# Altium schematic sheet MCU.SchDoc
size A4; SheetNumber: 2; SheetTotal: 4
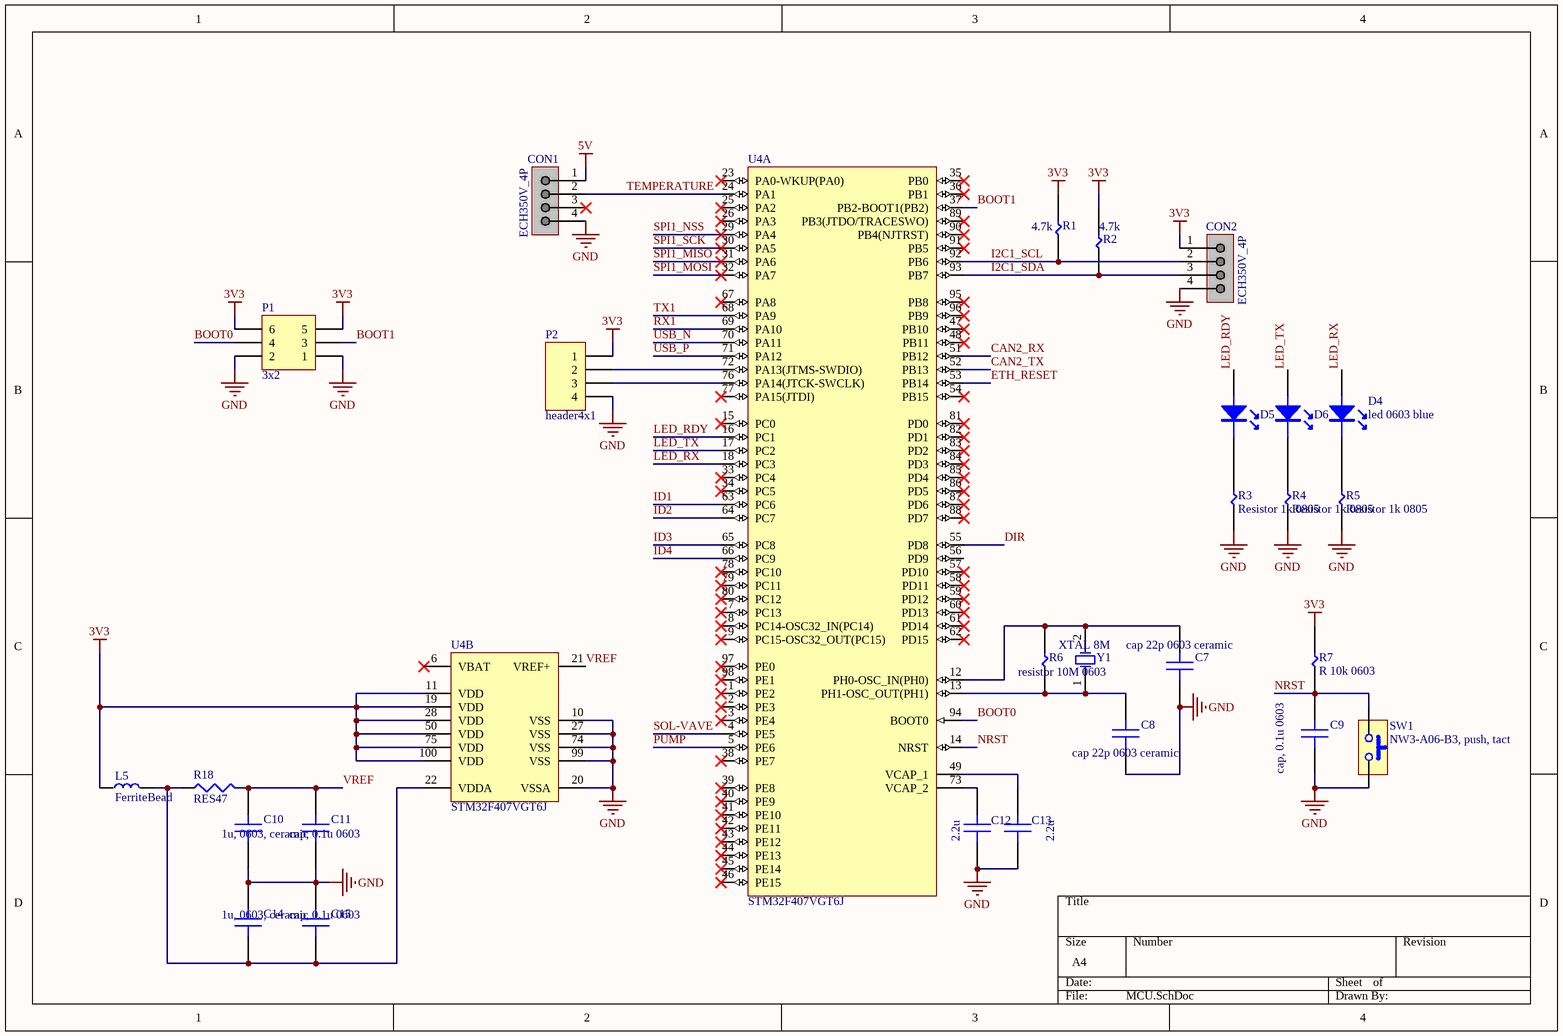
[diagram p0: MCU.SchDoc]

## Parts
C7  cap 22p 0603 ceramic  [CAP22p_0603_ceramic]
C8  cap 22p 0603 ceramic  [CAP22p_0603_ceramic]
C9  cap, 0.1u 0603  [CAP0.1u_0603_ceramic]
C10  1u, 0603, ceramic  [CAP1u_0603_ceramic]
C11  cap, 0.1u 0603  [CAP0.1u_0603_ceramic]
C12  2.2u  [CAP2.2u_0603]
C13  2.2u  [CAP2.2u_0603]
C14  1u, 0603, ceramic  [CAP1u_0603_ceramic]
C15  cap, 0.1u 0603  [CAP0.1u_0603_ceramic]
CON1  ECH350V_4P  [CON4P_ECH350V]
CON2  ECH350V_4P  [CON4P_ECH350V]
D4  led 0603 blue  [LED0603_BLUE]
D5  LED  [LED0603_GREEN]  (value not drawn)
D6  LED  [LED0603_GREEN]  (value not drawn)
L5  FerriteBead  [FerriteBD1608_102]
P1  3x2  [HDR3X2]
P2  header4x1  [HEADER4X1]
R1  4.7k  [RES4.7k_0603]
R2  4.7k  [RES4.7k_0603]
R3  Resistor 1k 0805  [RES1K_0805]
R4  Resistor 1k 0805  [RES1K_0805]
R5  Resistor 1k 0805  [RES1K_0805]
R6  resistor 10M 0603  [RES10M_0603]
R7  R 10k 0603  [RES10K_0603]
R18  RES47  [RES47_0603]
SW1  NW3-A06-B3, push, tact  [SW_TACT1]
U4  STM32F407VGT6J  [STM-LQFP100_L]  (parts A,B of 2)
Y1  XTAL 8M  [XTAL_SMD_8M]

## Nets
3V3: CON2.1 L5.1 P1.5 P1.6 P2.1 R1.2 R2.2 R7.2 U4.11(VDD) U4.19(VDD) U4.28(VDD) U4.50(VDD) U4.75(VDD) U4.100(VDD)
5V: CON1.1
GND: C7.1 C8.1 C9.1 C10.1 C11.1 C12.1 C13.1 C14.2 C15.2 CON1.4 CON2.4 P1.1 P1.2 P2.4 R3.1 R4.1 R5.1 SW1.2 U4.10(VSS) U4.20(VSSA) U4.27(VSS) U4.74(VSS) U4.99(VSS)
BOOT0: P1.4 U4.94(BOOT0)
BOOT1: P1.3 U4.37(PB2-BOOT1(PB2))
CAN2_RX: U4.51(PB12)
CAN2_TX: U4.52(PB13)
DIR: U4.55(PD8)
ETH_RESET: U4.53(PB14)
I2C1_SCL: CON2.2 R1.1 U4.92(PB6)
I2C1_SDA: CON2.3 R2.1 U4.93(PB7)
ID1: U4.63(PC6)
ID2: U4.64(PC7)
ID3: U4.65(PC8)
ID4: U4.66(PC9)
LED_RDY: D5.A U4.16(PC1)
LED_RX: D4.A U4.18(PC3)
LED_TX: D6.A U4.17(PC2)
NRST: C9.2 R7.1 SW1.1 U4.14(NRST)
PUMP: U4.5(PE6)
RX1: U4.69(PA10)
SOL-VAVE: U4.4(PE5)
SPI1_MISO: U4.31(PA6)
SPI1_MOSI: U4.32(PA7)
SPI1_NSS: U4.29(PA4)
SPI1_SCK: U4.30(PA5)
TEMPERATURE: CON1.2 U4.24(PA1)
TX1: U4.68(PA9)
USB_N: U4.70(PA11)
USB_P: U4.71(PA12)
VREF: C10.2 C11.2 R18.2 U4.21(VREF+)
NetC7_2: C7.2 R6.2 U4.12(PH0-OSC_IN(PH0)) Y1.2(OSC2)
NetC8_2: C8.2 R6.1 U4.13(PH1-OSC_OUT(PH1)) Y1.1(OSC1)
NetC12_2: C12.2 U4.73(VCAP_2)
NetC13_2: C13.2 U4.49(VCAP_1)
NetC14_1: C14.1 C15.1 L5.2 R18.1 U4.22(VDDA)
NetD4_K: D4.K R5.2
NetD5_K: D5.K R3.2
NetD6_K: D6.K R4.2
NetP2_2: P2.2 U4.72(PA13(JTMS-SWDIO))
NetP2_3: P2.3 U4.76(PA14(JTCK-SWCLK))

Not connected (* = marked no-connect by the designer): CON1 3(150)*; U4 1(PE2)* 2(PE3)* 3(PE4)* 6(VBAT)* 7(PC13)* 8(PC14-OSC32_IN(PC14))* 9(PC15-OSC32_OUT(PC15))* 15(PC0)* 23(PA0-WKUP(PA0))* 25(PA2)* 26(PA3)* 33(PC4)* 34(PC5)* 35(PB0)* 36(PB1)* 38(PE7)* 39(PE8)* 40(PE9)* 41(PE10)* 42(PE11)* 43(PE12)* 44(PE13)* 45(PE14)* 46(PE15)* 47(PB10)* 48(PB11)* 54(PB15)* 56(PD9) 57(PD10)* 58(PD11)* 59(PD12)* 60(PD13)* 61(PD14)* 62(PD15)* 67(PA8)* 77(PA15(JTDI))* 78(PC10)* 79(PC11)* 80(PC12)* 81(PD0)* 82(PD1)* 83(PD2)* 84(PD3)* 85(PD4)* 86(PD5)* 87(PD6)* 88(PD7)* 89(PB3(JTDO/TRACESWO))* 90(PB4(NJTRST))* 91(PB5)* 95(PB8)* 96(PB9)* 97(PE0)* 98(PE1)*

## Library data of the parts
C7 C8 = CAP22p_0603_ceramic
C9 C11 C15 = CAP0.1u_0603_ceramic
C10 C14 = CAP1u_0603_ceramic
C12 C13 = CAP2.2u_0603
CON1 CON2 = CON4P_ECH350V: Connector, Terminal block 4p_ECH350V
D4 = LED0603_BLUE
D5 D6 = LED0603_GREEN
L5 = FerriteBD1608_102: FCM1608KF-102T02, 200mA 1 700mΩ 1kΩ@100MHz ±25% 0603 Ferrite Beads ROHS; Manufacturer: Tai Tech; Supplier 1: Digikey; Manufacturer Part Number: FCM1608KF-102T02; RoHS: No; Category: Ferrite Beads and Chips; Stock 1: 15000; Pricing 1: 1=0.1, 10=0.025, 25=0.0224, 50=0.0202, 100=0.0182, 250=0.01332, 500=0.0097, 1000=0.00949 (USD); Supplier Part Number 1: 4816-FCM1608KF-102T02CT-ND
P1 = HEADER3X2: header 3x2
R1 R2 = RES4.7k_0603
R3-R5 = RES1K_0805
R6 = RES10M_0603
R7 = RES10K_0603
R18 = RES47_0603
SW1 = SW_TACT1: NW3-A06-B3
U4 = CMP-0243-00034-2: ARM Cortex-M4 32-bit MCU+FPU, 210 DMIPS, 1024 kB Flash, 192 kB Internal RAM, 82 I/Os, 100-pin LQFP, -40 to 85 degC, Tray; Manufacturer: STMicroelectronics; Internal RAM Size (kB): 192; Operating Frequency(F) (Processor speed) (MHz): 168; FLASH Size (Prog) (kB): 1024; I/Os (High Current): 82; Supply Voltage(Vcc) max (V): 3.6; D/A Converter: 2x12-bit; Supply Voltage(Vcc) min (V): 1.8; PackageReference: LQFP100; ComponentLink2URL: http://www.st.com/st-web-ui/static/active/en/resource/technical/document/datasheet/DM00037051.pdf; Packing: Tray; ComponentLink3Description: Package Specification; PackageDescription: 100-Pin Low Profile Quad Flat Package, 14 x 14 mm Body, 0.5 mm Pitch; PackageVersion: Rev. 1, 06/2013; ComponentLink1Description: Manufacturer URL; PartNumber: STM32F407VGT6J; Core: ARM Cortex-M4; ComponentLink2Description: Datasheet; ComponentLink1URL: http://www.st.com/web/en/home.html; Mounting Technology: Surface Mount; DatasheetVersion: Rev. 4; ComponentLink3URL: http://www.st.com/st-web-ui/static/active/en/resource/technical/document/data_brief/DM00071938.pdf
Y1 = XTAL8M